# Altium project Anahata_Control_PCB.PrjPcb
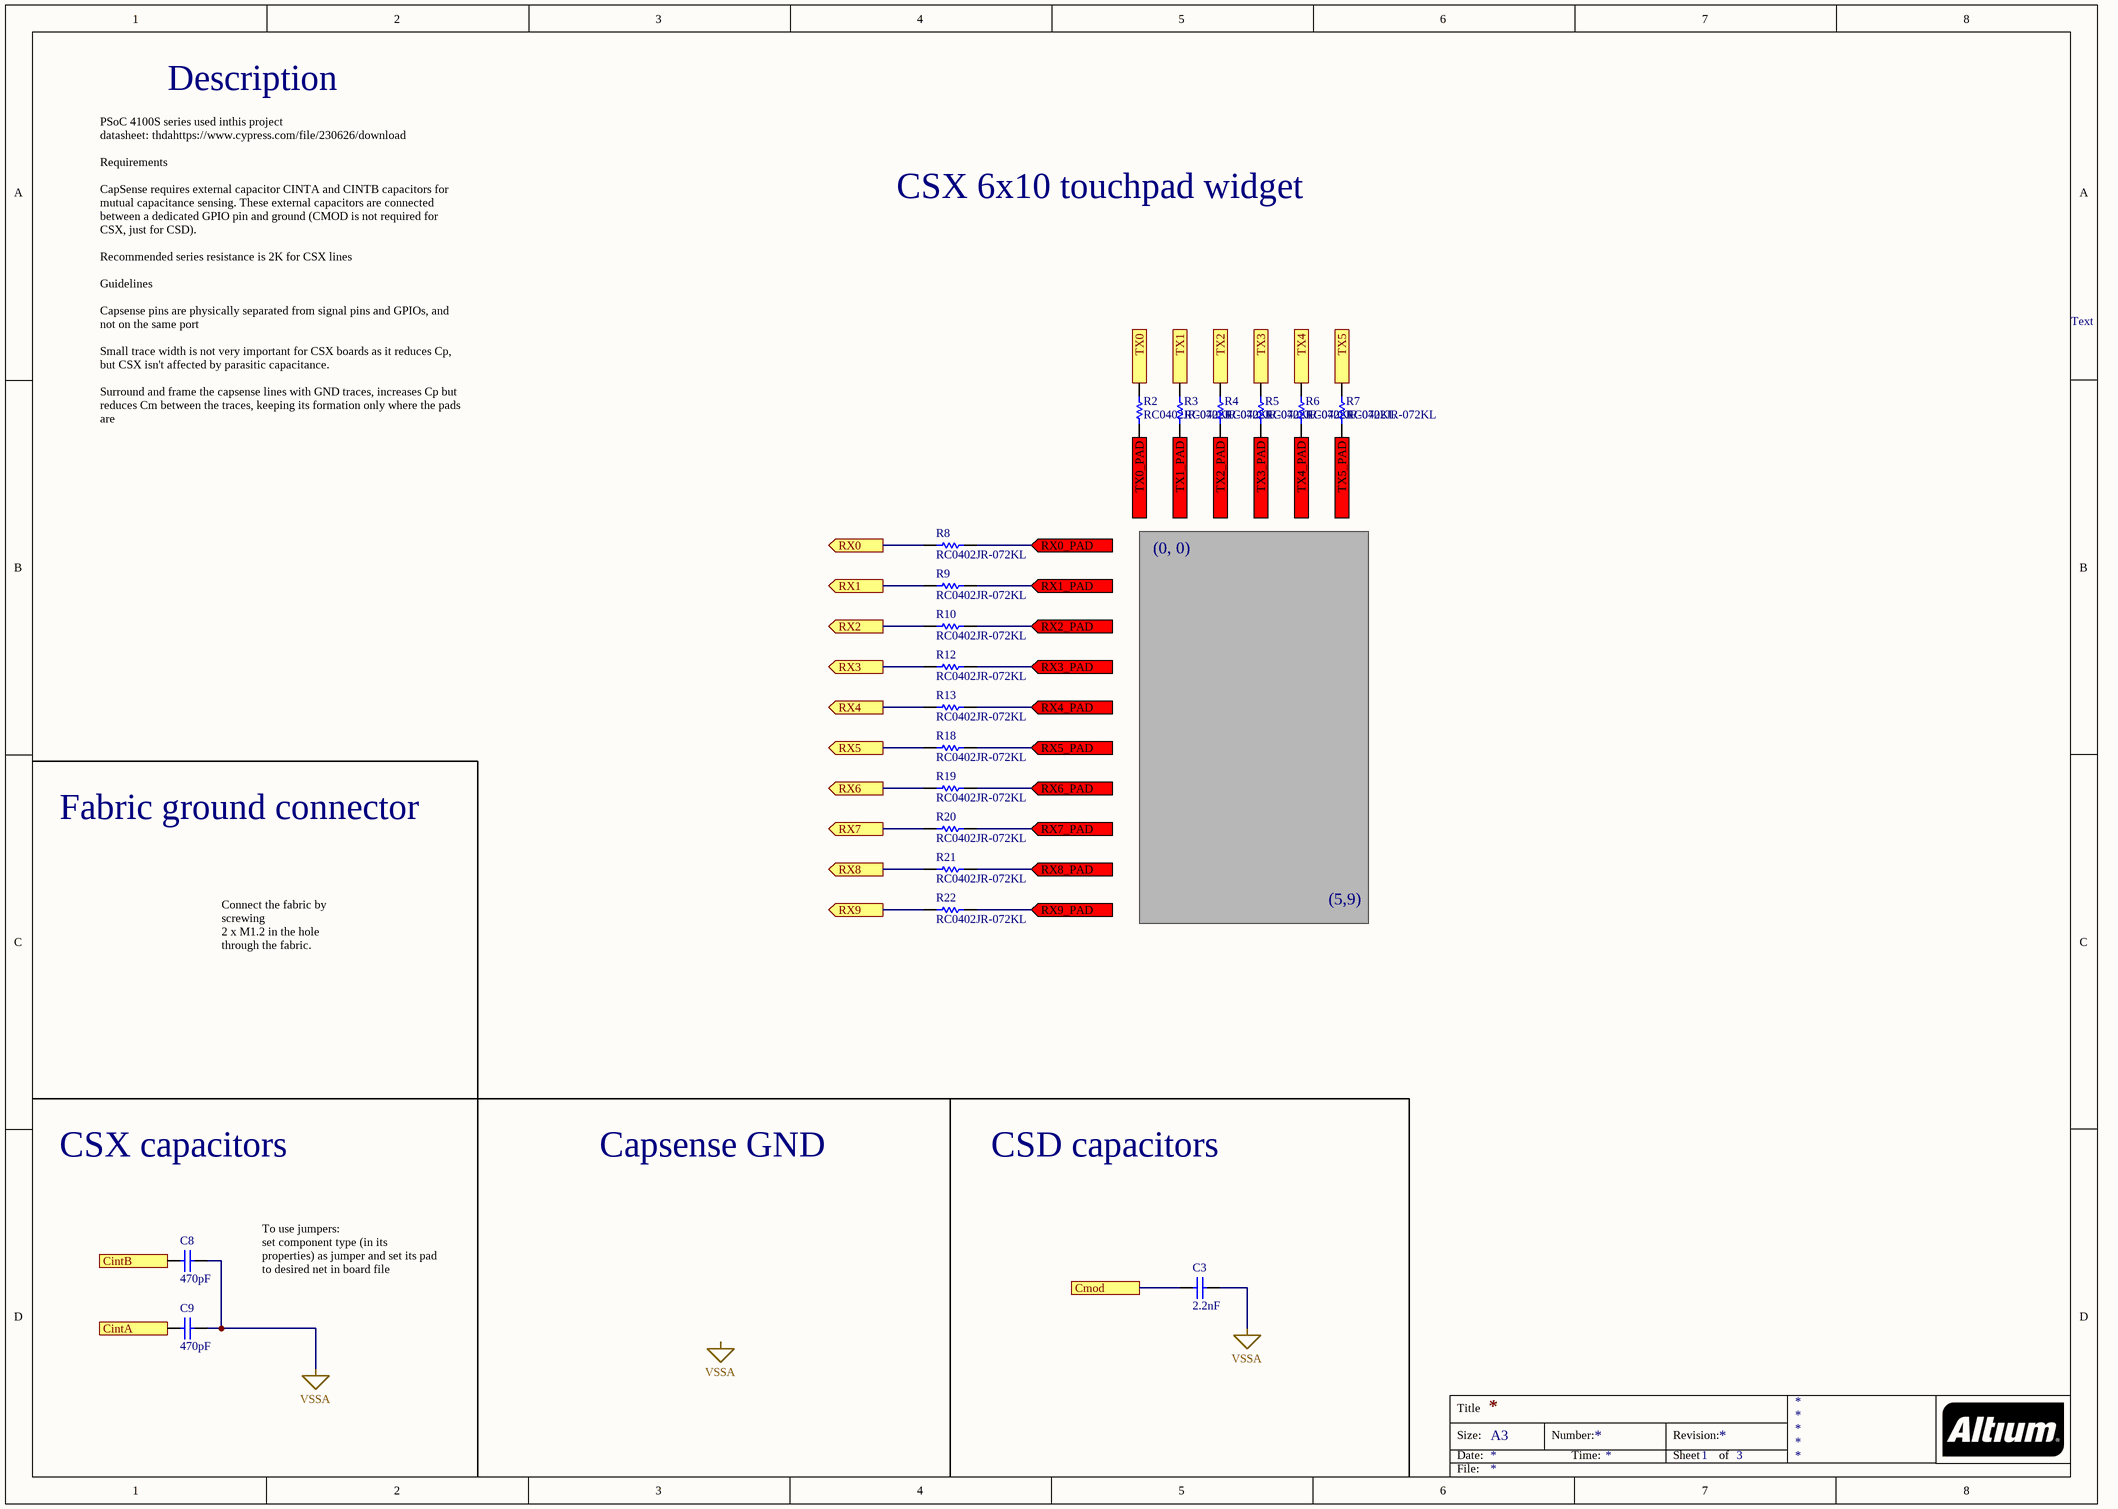
[diagram p0: CapSense.SchDoc]
3 sheets, 34 parts. Net scope: flat (ports and power ports of the same name join across sheets).
Board file: Anahata_Control_PCB.PcbDoc
Sheets:
  CapSense.SchDoc
  CY8C4124LQI-S413.SchDoc
  Power.SchDoc

## Sheet CapSense.SchDoc
size A3; SheetNumber: 1; SheetTotal: 3

### Parts
C3  2.2nF  [CAPC1005X56X25ML10T15]
C8  470pF  [CAPC0603(1608)100_N]
C9  470pF  [CAPC0603(1608)100_N]
R2  RC0402JR-072KL  [RESC1005X40X25ML05T10]
R3  RC0402JR-072KL  [RESC1005X40X25ML05T10]
R4  RC0402JR-072KL  [RESC1005X40X25ML05T10]
R5  RC0402JR-072KL  [RESC1005X40X25ML05T10]
R6  RC0402JR-072KL  [RESC1005X40X25ML05T10]
R7  RC0402JR-072KL  [RESC1005X40X25ML05T10]
R8  RC0402JR-072KL  [RESC1005X40X25ML05T10]
R9  RC0402JR-072KL  [RESC1005X40X25ML05T10]
R10  RC0402JR-072KL  [RESC1005X40X25ML05T10]
R12  RC0402JR-072KL  [RESC1005X40X25ML05T10]
R13  RC0402JR-072KL  [RESC1005X40X25ML05T10]
R18  RC0402JR-072KL  [RESC1005X40X25ML05T10]
R19  RC0402JR-072KL  [RESC1005X40X25ML05T10]
R20  RC0402JR-072KL  [RESC1005X40X25ML05T10]
R21  RC0402JR-072KL  [RESC1005X40X25ML05T10]
R22  RC0402JR-072KL  [RESC1005X40X25ML05T10]

### Ports
CintA, CintB, Cmod, RX0 (out), RX0_PAD (in), RX1 (out), RX1_PAD (in), RX2 (out), RX2_PAD (in), RX3 (out), RX3_PAD (in), RX4 (out), RX4_PAD (in), RX5 (out), RX5_PAD (in), RX6 (out), RX6_PAD (in), RX7 (out), RX7_PAD (in), RX8 (out), RX8_PAD (in), RX9 (out), RX9_PAD (in), TX0 (in), TX0_PAD (out), TX1 (in), TX1_PAD (out), TX2 (in), TX2_PAD (out), TX3 (in), TX3_PAD (out), TX4 (in), TX4_PAD (out), TX5 (in), TX5_PAD (out)

### Nets
VSSA: C3.2 C8.2 C9.2  [project net GND]
CintA: C9.1 ; port CintA
CintB: C8.1 ; port CintB
Cmod: C3.1 ; port Cmod
RX0: R8.1 ; port RX0
RX0_PAD: R8.2 ; port RX0_PAD
RX1: R9.1 ; port RX1
RX1_PAD: R9.2 ; port RX1_PAD
RX2: R10.1 ; port RX2
RX2_PAD: R10.2 ; port RX2_PAD
RX3: R12.1 ; port RX3
RX3_PAD: R12.2 ; port RX3_PAD
RX4: R13.1 ; port RX4
RX4_PAD: R13.2 ; port RX4_PAD
RX5: R18.1 ; port RX5
RX5_PAD: R18.2 ; port RX5_PAD
RX6: R19.1 ; port RX6
RX6_PAD: R19.2 ; port RX6_PAD
RX7: R20.1 ; port RX7
RX7_PAD: R20.2 ; port RX7_PAD
RX8: R21.1 ; port RX8
RX8_PAD: R21.2 ; port RX8_PAD
RX9: R22.1 ; port RX9
RX9_PAD: R22.2 ; port RX9_PAD
TX0: R2.2 ; port TX0
TX0_PAD: R2.1 ; port TX0_PAD
TX1: R3.2 ; port TX1
TX1_PAD: R3.1 ; port TX1_PAD
TX2: R4.2 ; port TX2
TX2_PAD: R4.1 ; port TX2_PAD
TX3: R5.2 ; port TX3
TX3_PAD: R5.1 ; port TX3_PAD
TX4: R6.2 ; port TX4
TX4_PAD: R6.1 ; port TX4_PAD
TX5: R7.2 ; port TX5
TX5_PAD: R7.1 ; port TX5_PAD

### Notes on the sheet
- Description
- CSX 6x10 touchpad widget
- Text
- PSoC 4100S series used inthis project
  datasheet: thdahttps://www.cypress.com/file/230626/download
  Requirements
  CapSense requires external capacitor CINTA and CINTB capacitors for mutual capacitance sensing. These external capacitors are connected between a dedicated GPIO pin and ground (CMOD is not required for CSX, just for CSD).
  Recommended series resistance is 2K for CSX lines
  Guidelines
  Capsense pins are physically separated from signal pins and GPIOs, and not on the same port
  Small trace width is not very important for CSX boards as it reduces Cp, but CSX isn't affected by parasitic capacitance.
  Surround and frame the capsense lines with GND traces, increases Cp but reduces Cm between the traces, keeping its formation only where the pads are
- (0, 0)
- Fabric ground connector
- (5,9)
- Connect the fabric by screwing
  2 x M1.2 in the hole through the fabric.
- CSX capacitors
- Capsense GND
- CSD capacitors
- To use jumpers:
  set component type (in its properties) as jumper and set its pad to desired net in board file
- Labels drawn without touching a wire or pin: VSSA
- Title
- Size:
- Date:
- A3
- Number:
- Time:
- Revision:
- Sheet
- of
- File:

### Library data of the parts
C3 = CMP-1034-02113-2: Manufacturer: AVX Interconnect / Elco; Part Number: 04026D105KAT2A
C8 C9 = CMP-1035-01661-1: CAP 470pF 10V ±10% 0603 (1608 Metric) Thickness 1mm SMD; Case-EIA: 0603; Tolerance: Â±10%; Case-Metric: 1608; Max Thickness: 1 mm; Rated Voltage: 10 V; Technology: SMT; Value: 470pF
R2-R10 R12 R13 R18-R22 = CMP-2002-07972-1: Manufacturer: Yageo / Phycomp; Part Number: RC0402JR-072KL

## Sheet CY8C4124LQI-S413.SchDoc: CY8C4125AZI-S433
size A3; SheetNumber: 2; SheetTotal: 3
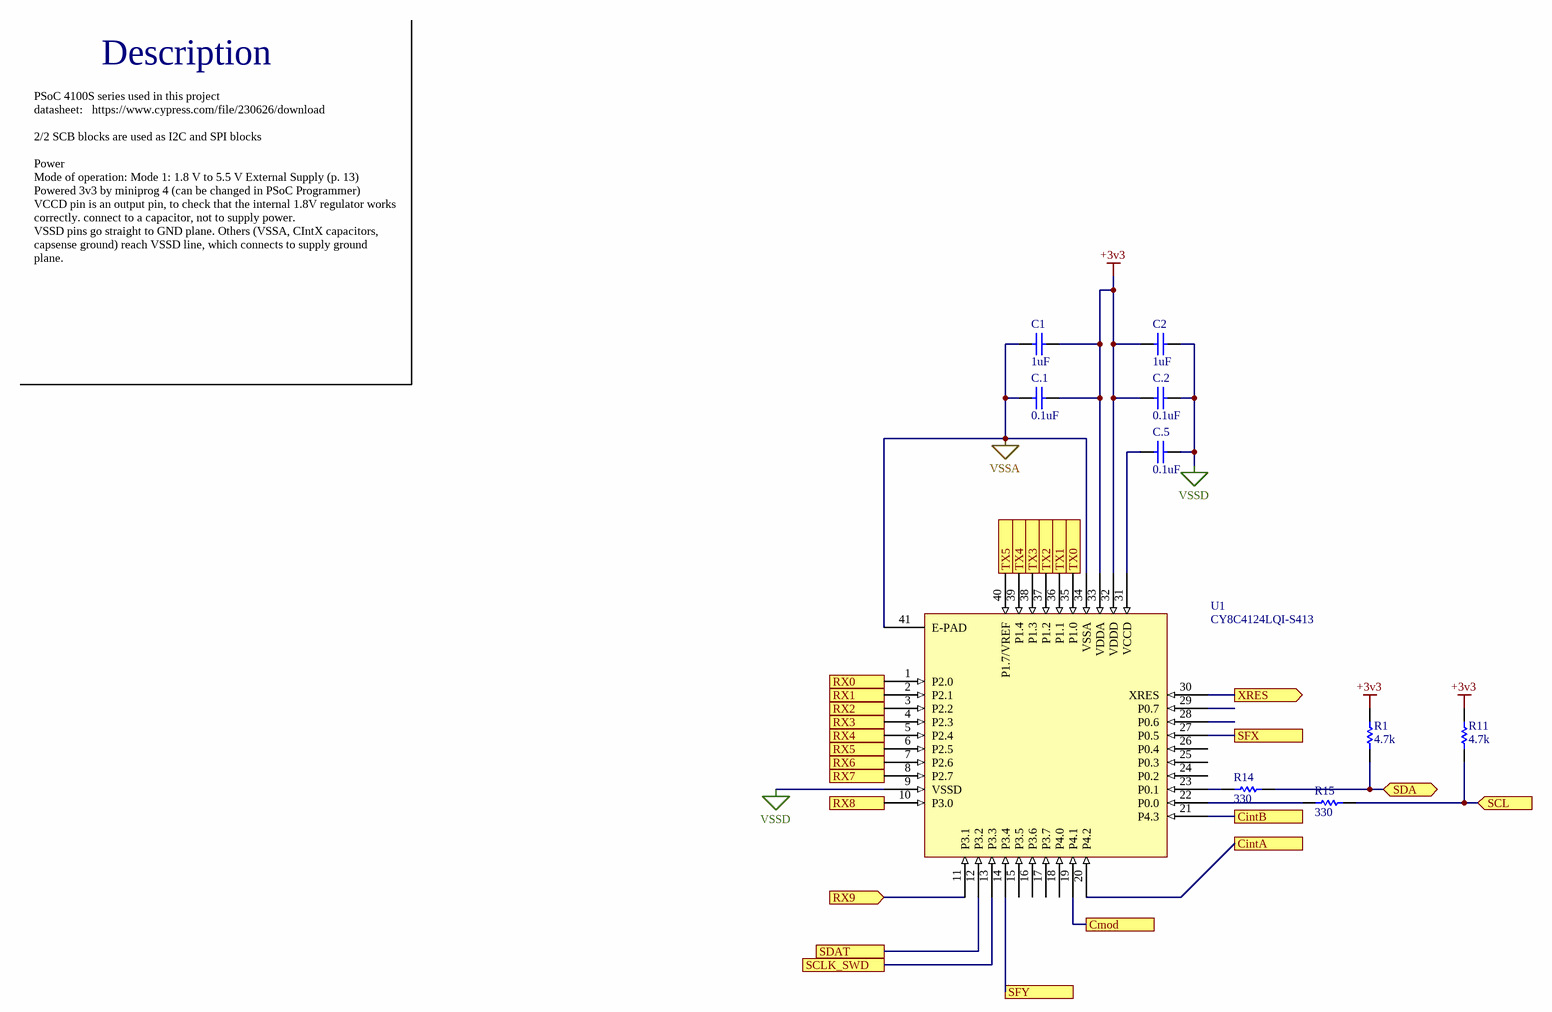
[diagram p1: CY8C4124LQI-S413.SchDoc]

### Parts
C1  1uF  [CAPC1005X56X25ML10T15]
C2  1uF  [CAPC1005X56X25ML10T15]
C.1  0.1uF  [CAPC1005X56X25ML10T15]
C.2  0.1uF  [CAPC1005X56X25ML10T15]
C.5  0.1uF  [CAPC1005X56X25ML10T15]
R1  4.7k  [RESC1005X40X25ML05T10]
R11  4.7k  [RESC1005X40X25ML05T10]
R14  330  [RESC1005X40X25ML05T10]
R15  330  [RESC1005X40X25ML05T10]
U1  CY8C4124LQI-S413  [CY8C4125LQS-S423]

### Ports
CintA, CintB, Cmod, RX0 (in), RX1 (in), RX2 (in), RX3 (in), RX4 (in), RX5 (in), RX6 (in), RX7 (in), RX8 (in), RX9 (in), SCL (in), SCLK_SWD, SDA (bidir), SDAT, SFX, SFY, TX0 (out), TX1 (out), TX2 (out), TX3 (out), TX4 (out), TX5 (out), XRES (out)

### Nets
+3v3: C1.2 C2.1 C.1.2 C.2.1 R1.2 R11.2 U1.32(VDDD) U1.33(VDDA)
VSSA: C1.1 C2.2 C.1.1 C.2.2 C.5.2 U1.9(VSSD) U1.34(VSSA) U1.41(E-PAD)  [also labelled VSSD]  [project net GND]
CintA: U1.20(P4.2) ; port CintA
CintB: U1.21(P4.3) ; port CintB
Cmod: U1.19(P4.1) ; port Cmod
RX0: U1.1(P2.0) ; port RX0
RX1: U1.2(P2.1) ; port RX1
RX2: U1.3(P2.2) ; port RX2
RX3: U1.4(P2.3) ; port RX3
RX4: U1.5(P2.4) ; port RX4
RX5: U1.6(P2.5) ; port RX5
RX6: U1.7(P2.6) ; port RX6
RX7: U1.8(P2.7) ; port RX7
RX8: U1.10(P3.0) ; port RX8
RX9: U1.11(P3.1) ; port RX9
SCL: R11.1 R15.2 ; port SCL
SCLK_SWD: U1.13(P3.3) ; port SCLK_SWD
SDA: R1.1 R14.2 ; port SDA
SDAT: U1.12(P3.2) ; port SDAT
SFX: U1.27(P0.5) ; port SFX
SFY: U1.14(P3.4) ; port SFY
TX0: U1.35(P1.0) ; port TX0
TX1: U1.36(P1.1) ; port TX1
TX2: U1.37(P1.2) ; port TX2
TX3: U1.38(P1.3) ; port TX3
TX4: U1.39(P1.4) ; port TX4
TX5: U1.40(P1.7/VREF) ; port TX5
XRES: U1.30(XRES) ; port XRES
NetC.5_1: C.5.1 U1.31(VCCD)
NetR14_1: R14.1 U1.23(P0.1)
NetR15_1: R15.1 U1.22(P0.0)

Not connected (* = marked no-connect by the designer): U1 15(P3.5) 16(P3.6) 17(P3.7) 18(P4.0) 24(P0.2) 25(P0.3) 26(P0.4) 28(P0.6) 29(P0.7)

### Notes on the sheet
- Description
- PSoC 4100S series used in this project
  datasheet:   https://www.cypress.com/file/230626/download
  2/2 SCB blocks are used as I2C and SPI blocks
  Power
  Mode of operation: Mode 1: 1.8 V to 5.5 V External Supply (p. 13)
  Powered 3v3 by miniprog 4 (can be changed in PSoC Programmer)
  VCCD pin is an output pin, to check that the internal 1.8V regulator works correctly. connect to a capacitor, not to supply power.
  VSSD pins go straight to GND plane. Others (VSSA, CIntX capacitors, capsense ground) reach VSSD line, which connects to supply ground plane.
- Title
- Size:
- Date:
- A3
- Number:
- Time:
- Revision:
- Sheet
- of
- File:

### Library data of the parts
C1 C2 C.1 C.2 C.5 = CMP-1034-02113-2: as C3 on sheet CapSense
R1 R11 R14 R15 = CMP-2002-07972-1: Part Number: RC0402JR-072KL; Manufacturer: Yageo / Phycomp

## Sheet Power.SchDoc
size A4; SheetNumber: 3; SheetTotal: 3
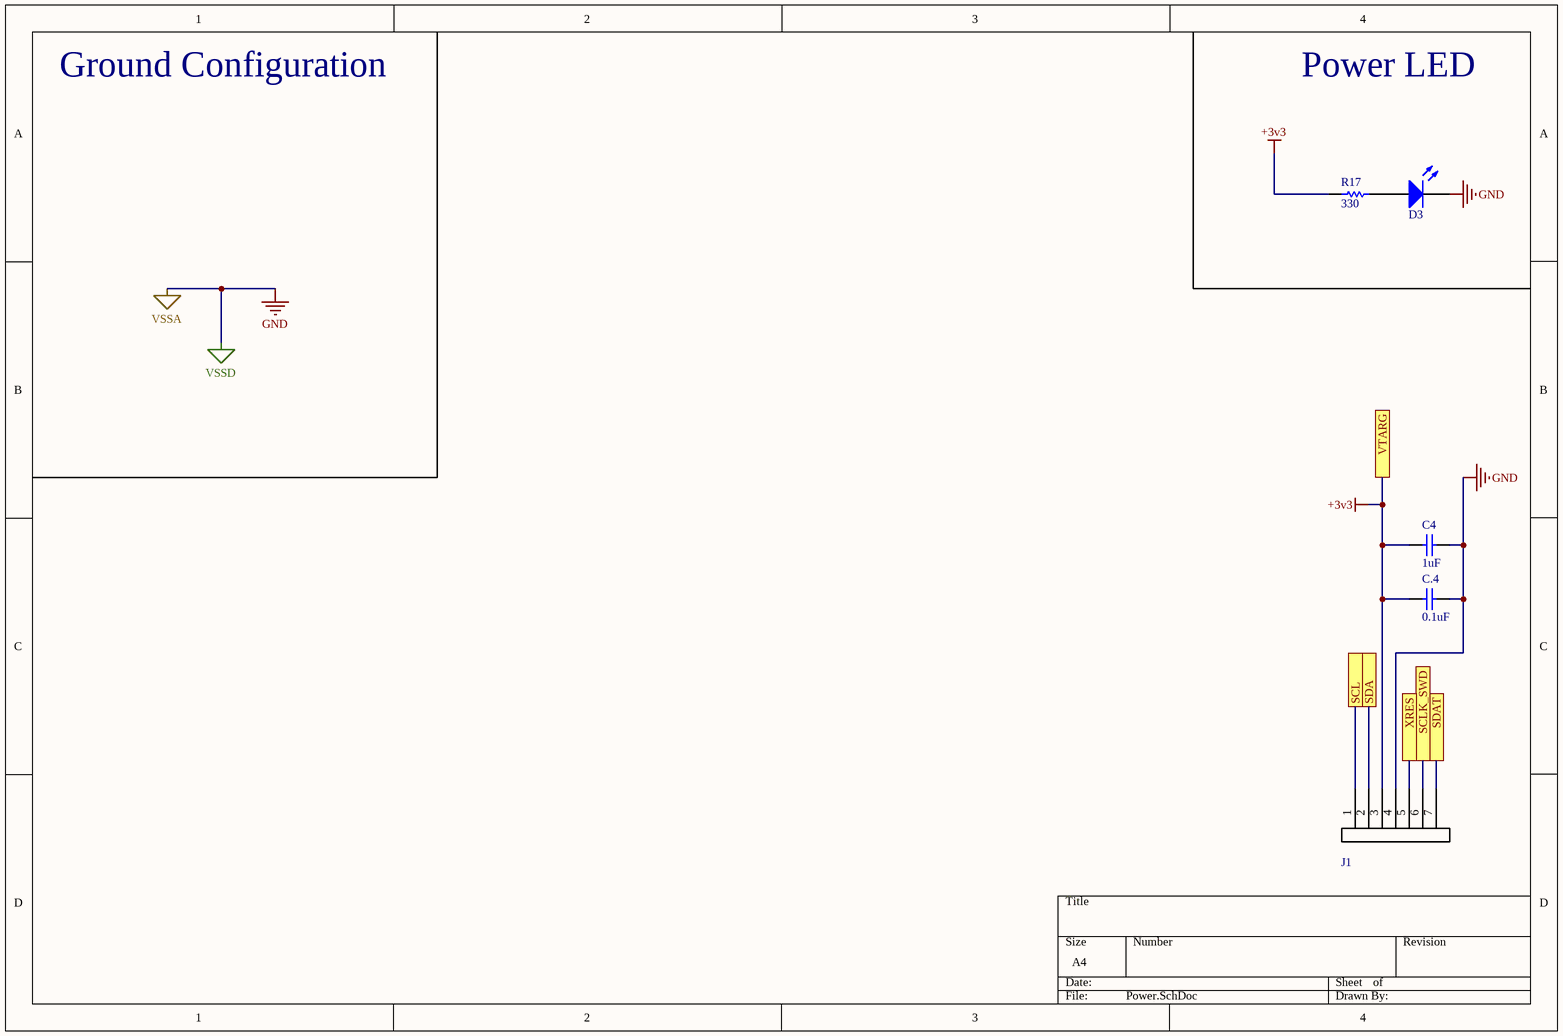
[diagram p2: Power.SchDoc]

### Parts
C4  1uF  [CAPC1005X56X25ML10T15]
C.4  0.1uF  [CAPC1005X56X25ML10T15]
D3  150060BS75000  [0603_A]  (value not drawn)
J1  BM07B-NSHSS-TBT (LF)(SN)  [BM07B-NSHSS-TBT (LF)(SN)]  (value not drawn)
R17  330  [RESC1005X40X25ML05T10]

### Ports
SCL, SCLK_SWD, SDA, SDAT, VTARG, XRES

### Nets
+3v3: C4.1 C.4.1 J1.3 R17.1 ; port VTARG
GND: C4.2 C.4.2 D3.1(K) J1.4  [also labelled VSSA, VSSD]
SCL: J1.1 ; port SCL
SCLK_SWD: J1.6 ; port SCLK_SWD
SDA: J1.2 ; port SDA
SDAT: J1.7 ; port SDAT
XRES: J1.5 ; port XRES
NetD3_2: D3.2(A) R17.2

### Notes on the sheet
- Ground Configuration
- Power LED

### Library data of the parts
C4 C.4 = CMP-1034-02113-2: as C3 on sheet CapSense
D3 = CMP-1426-00003-1: SMD mono-color Chip LED, WL-SMCW, Blue; Manufacturer: Wuerth Elektronik; Color: Blue; ComponentLink2Description: Datasheet; ComponentLink2URL: http://katalog.we-online.com/led/datasheet/150060BS75000.pdf; ComponentLink1URL: http://www.we-online.com; PackageReference: 0603_A; PartNumber: 150060BS75000; ComponentLink1Description: Manufacturer URL
R17 = CMP-2002-07972-1: as R1 on sheet CY8C4124LQI-S413

## Nets that join several sheets
+3v3: CY8C4124LQI-S413 (8 pins), Power (C4.1 C.4.1 J1.3 R17.1)
GND: CapSense (C3.2 C8.2 C9.2), CY8C4124LQI-S413 (8 pins), Power (C4.2 C.4.2 D3.1 J1.4)
CintA: CapSense (C9.1), CY8C4124LQI-S413 (U1.20)
CintB: CapSense (C8.1), CY8C4124LQI-S413 (U1.21)
Cmod: CapSense (C3.1), CY8C4124LQI-S413 (U1.19)
RX0: CapSense (R8.1), CY8C4124LQI-S413 (U1.1)
RX1: CapSense (R9.1), CY8C4124LQI-S413 (U1.2)
RX2: CapSense (R10.1), CY8C4124LQI-S413 (U1.3)
RX3: CapSense (R12.1), CY8C4124LQI-S413 (U1.4)
RX4: CapSense (R13.1), CY8C4124LQI-S413 (U1.5)
RX5: CapSense (R18.1), CY8C4124LQI-S413 (U1.6)
RX6: CapSense (R19.1), CY8C4124LQI-S413 (U1.7)
RX7: CapSense (R20.1), CY8C4124LQI-S413 (U1.8)
RX8: CapSense (R21.1), CY8C4124LQI-S413 (U1.10)
RX9: CapSense (R22.1), CY8C4124LQI-S413 (U1.11)
SCL: CY8C4124LQI-S413 (R11.1 R15.2), Power (J1.1)
SCLK_SWD: CY8C4124LQI-S413 (U1.13), Power (J1.6)
SDA: CY8C4124LQI-S413 (R1.1 R14.2), Power (J1.2)
SDAT: CY8C4124LQI-S413 (U1.12), Power (J1.7)
TX0: CapSense (R2.2), CY8C4124LQI-S413 (U1.35)
TX1: CapSense (R3.2), CY8C4124LQI-S413 (U1.36)
TX2: CapSense (R4.2), CY8C4124LQI-S413 (U1.37)
TX3: CapSense (R5.2), CY8C4124LQI-S413 (U1.38)
TX4: CapSense (R6.2), CY8C4124LQI-S413 (U1.39)
TX5: CapSense (R7.2), CY8C4124LQI-S413 (U1.40)
XRES: CY8C4124LQI-S413 (U1.30), Power (J1.5)